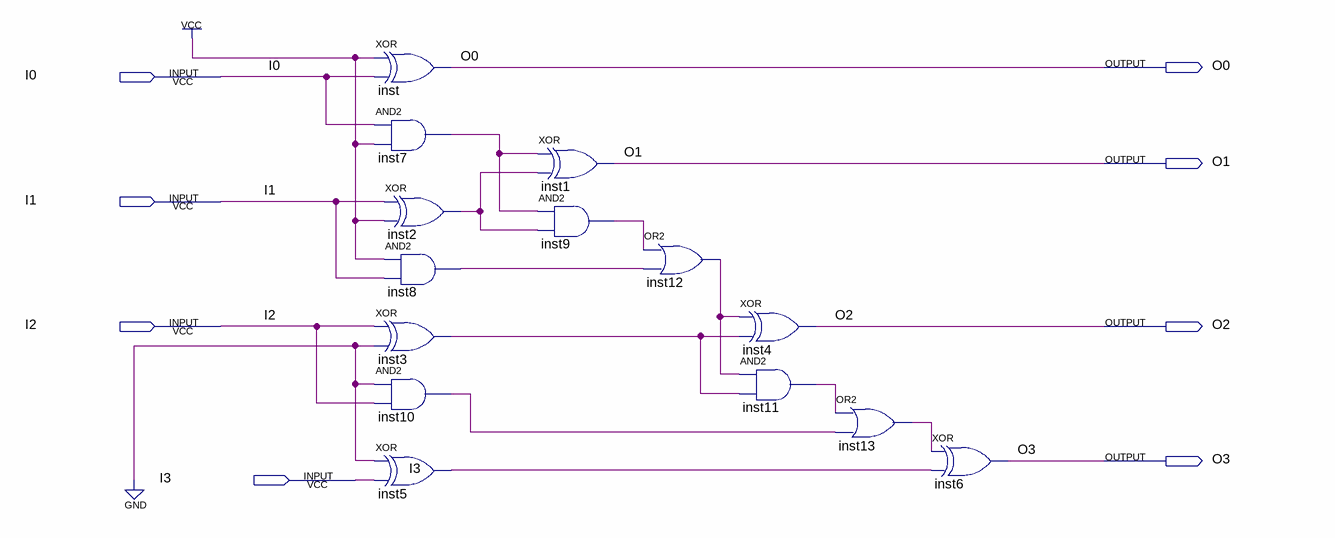
[diagram p0: schematic sheet]
// Quartus schematic Adder4.bdf as structural Verilog: 14 symbols, 8 pins
module Adder4 (
  input  I0,
  input  I1,
  input  I2,
  input  I3,
  output O0,
  output O1,
  output O2,
  output O3
);

  wire inst2_out, inst3_out, inst5_out, inst7_out, inst8_out, inst9_out, inst10_out, inst11_out, inst12_out,
       inst13_out;

  xor inst (O0, 1'b1, I0);
  and inst7 (inst7_out, I0, 1'b1);
  xor inst2 (inst2_out, I1, 1'b1);
  and inst8 (inst8_out, 1'b1, I1);
  xor inst3 (inst3_out, I2, 1'b0);
  and inst10 (inst10_out, 1'b0, I2);
  xor inst5 (inst5_out, 1'b0, I3);
  xor inst1 (O1, inst7_out, inst2_out);
  and inst9 (inst9_out, inst7_out, inst2_out);
  or inst12 (inst12_out, inst9_out, inst8_out);
  xor inst4 (O2, inst12_out, inst3_out);
  and inst11 (inst11_out, inst12_out, inst3_out);
  or inst13 (inst13_out, inst11_out, inst10_out);
  xor inst6 (O3, inst13_out, inst5_out);
endmodule
